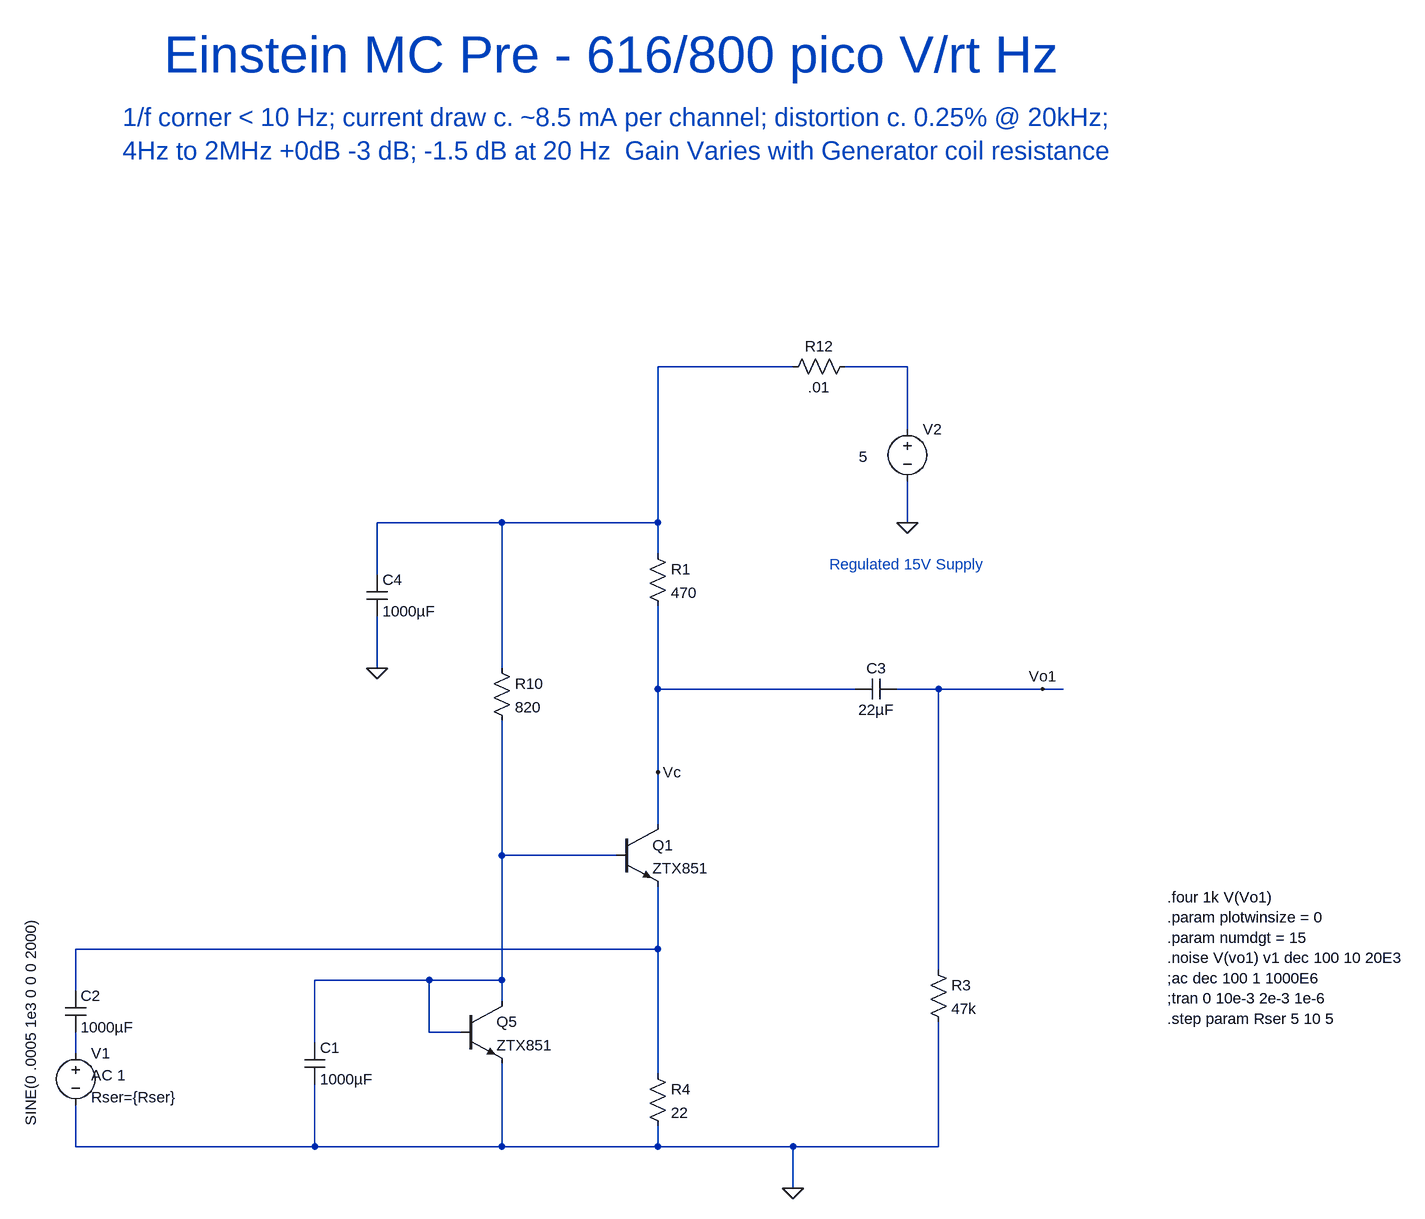
[diagram p0: schematic Einstein.asc]
Einstein.asc, the LTspice schematic file:
Version 4
SHEET 1 1520 1304
WIRE -1280 16 -1488 16
WIRE -1104 16 -1200 16
WIRE -1104 112 -1104 16
WIRE -1728 256 -1920 256
WIRE -1488 256 -1488 16
WIRE -1488 256 -1728 256
WIRE -1104 256 -1104 192
WIRE -1488 304 -1488 256
WIRE -1920 336 -1920 256
WIRE -1920 480 -1920 400
WIRE -1728 480 -1728 256
WIRE -1488 512 -1488 384
WIRE -1184 512 -1488 512
WIRE -1056 512 -1120 512
WIRE -896 512 -1056 512
WIRE -864 512 -896 512
WIRE -1488 640 -1488 512
WIRE -1488 720 -1488 640
WIRE -1728 768 -1728 560
WIRE -1552 768 -1728 768
WIRE -1488 912 -1488 816
WIRE -1488 912 -2384 912
WIRE -1056 944 -1056 512
WIRE -1840 960 -2016 960
WIRE -1728 960 -1728 768
WIRE -1728 960 -1840 960
WIRE -2384 976 -2384 912
WIRE -1728 992 -1728 960
WIRE -1840 1040 -1840 960
WIRE -1792 1040 -1840 1040
WIRE -2016 1056 -2016 960
WIRE -2384 1072 -2384 1040
WIRE -1488 1104 -1488 912
WIRE -2384 1216 -2384 1152
WIRE -2016 1216 -2016 1120
WIRE -2016 1216 -2384 1216
WIRE -1728 1216 -1728 1088
WIRE -1728 1216 -2016 1216
WIRE -1488 1216 -1488 1184
WIRE -1488 1216 -1728 1216
WIRE -1280 1216 -1488 1216
WIRE -1056 1216 -1056 1024
WIRE -1056 1216 -1280 1216
WIRE -1280 1280 -1280 1216
FLAG -1104 256 0
FLAG -1280 1280 0
FLAG -896 512 Vo1
FLAG -1488 640 Vc
FLAG -1920 480 0
SYMBOL npn -1552 720 R0
SYMATTR InstName Q1
SYMATTR Value ZTX851
SYMBOL voltage -2384 1056 R0
WINDOW 3 -69 -194 VRight 2
WINDOW 123 24 50 Left 2
WINDOW 39 24 84 Left 2
SYMATTR Value SINE(0 .0005 1e3 0 0 0 2000)
SYMATTR Value2 AC 1
SYMATTR SpiceLine Rser={Rser}
SYMATTR InstName V1
SYMBOL voltage -1104 96 R0
WINDOW 3 -75 59 Left 2
WINDOW 123 24 50 Left 2
WINDOW 39 0 0 Left 2
SYMATTR Value 5
SYMATTR InstName V2
SYMBOL cap -1120 496 R90
WINDOW 0 0 32 VBottom 2
WINDOW 3 32 32 VTop 2
SYMATTR InstName C3
SYMATTR Value 22µF
SYMBOL res -1504 288 R0
SYMATTR InstName R1
SYMATTR Value 470
SYMBOL res -1072 928 R0
SYMATTR InstName R3
SYMATTR Value 47k
SYMBOL res -1504 1088 R0
SYMATTR InstName R4
SYMATTR Value 22
SYMBOL cap -1936 336 R0
SYMATTR InstName C4
SYMATTR Value 1000µF
SYMBOL res -1184 0 R90
WINDOW 0 0 56 VBottom 2
WINDOW 3 32 56 VTop 2
SYMATTR InstName R12
SYMATTR Value .01
SYMBOL cap -2400 976 R0
SYMATTR InstName C2
SYMATTR Value 1000µF
SYMBOL npn -1792 992 R0
SYMATTR InstName Q5
SYMATTR Value ZTX851
SYMBOL res -1744 464 R0
SYMATTR InstName R10
SYMATTR Value 820
SYMBOL cap -2032 1056 R0
SYMATTR InstName C1
SYMATTR Value 1000µF
TEXT -704 832 Left 2 !.four 1k V(Vo1)\n.param plotwinsize = 0\n.param numdgt = 15\n.noise V(vo1) v1 dec 100 10 20E3\n;ac dec 100 1 1000E6\n;tran 0 10e-3 2e-3 1e-6\n.step param Rser 5 10 5
TEXT -2248 -464 Left 6 ;Einstein MC Pre - 616/800 pico V/rt Hz
TEXT -2312 -368 Left 4 ;1/f corner < 10 Hz; current draw c. ~8.5 mA per channel; distortion c. 0.25% @ 20kHz;\n4Hz to 2MHz +0dB -3 dB; -1.5 dB at 20 Hz  Gain Varies with Generator coil resistance
TEXT -1224 320 Left 2 ;Regulated 15V Supply

The netlist it stands for:
* Einstein.asc
Q1 Vc N003 N004 0 ZTX851
V1 N005 0 SINE(0 .0005 1e3 0 0 0 2000) AC 1 Rser={Rser}
V2 N002 0 5
C3 Vo1 Vc 22µF
R1 N001 Vc 470
R3 Vo1 0 47k
R4 N004 0 22
C4 N001 0 1000µF
R12 N002 N001 .01
C2 N004 N005 1000µF
Q5 N003 N003 0 0 ZTX851
R10 N001 N003 820
C1 N003 0 1000µF
.model NPN NPN
.model PNP PNP
.lib standard.bjt
.four 1k V(Vo1)
.param plotwinsize = 0
.param numdgt = 15
.noise V(vo1) v1 dec 100 10 20E3
;ac dec 100 1 1000E6
;tran 0 10e-3 2e-3 1e-6
.step param Rser 5 10 5
* Einstein MC Pre - 616/800 pico V/rt Hz
* 1/f corner < 10 Hz; current draw c. ~8.5 mA per channel; distortion c. 0.25% @ 20kHz;
* 4Hz to 2MHz +0dB -3 dB; -1.5 dB at 20 Hz  Gain Varies with Generator coil resistance
* Regulated 15V Supply
.backanno
.end